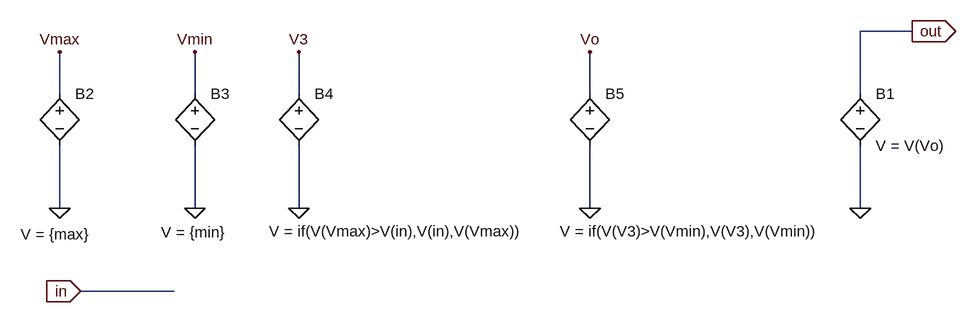
[diagram p0: schematic Clamp1.asc]
Clamp1.asc, the LTspice schematic file:
Version 4
SHEET 1 880 680
WIRE 704 -80 624 -80
WIRE -608 16 -608 -48
WIRE -400 16 -400 -48
WIRE -240 16 -240 -48
WIRE 208 16 208 -48
WIRE 624 16 624 -80
WIRE -608 192 -608 96
WIRE -400 192 -400 96
WIRE -240 192 -240 96
WIRE 208 192 208 96
WIRE 624 192 624 96
WIRE -432 320 -576 320
FLAG 624 192 0
FLAG 704 -80 out
IOPIN 704 -80 Out
FLAG -608 192 0
FLAG -400 192 0
FLAG -576 320 in
IOPIN -576 320 In
FLAG -608 -48 Vmax
FLAG -400 -48 Vmin
FLAG -240 192 0
FLAG -240 -48 V3
FLAG 208 192 0
FLAG 208 -48 Vo
SYMBOL bv 624 0 R0
SYMATTR InstName B1
SYMATTR Value V = V(Vo)
SYMBOL bv -608 0 R0
WINDOW 3 -60 232 Left 0
SYMATTR Value V = {max}
SYMATTR InstName B2
SYMBOL bv -400 0 R0
WINDOW 3 -52 229 Left 0
SYMATTR Value V = {min}
SYMATTR InstName B3
SYMBOL bv -240 0 R0
WINDOW 3 -46 228 Left 0
SYMATTR Value V = if(V(Vmax)>V(in),V(in),V(Vmax))
SYMATTR InstName B4
SYMBOL bv 208 0 R0
WINDOW 3 -46 228 Left 0
SYMATTR Value V = if(V(V3)>V(Vmin),V(V3),V(Vmin))
SYMATTR InstName B5

The netlist it stands for:
* Clamp1.asc
B1 out 0 V = V(Vo)
B2 Vmax 0 V = {max}
B3 Vmin 0 V = {min}
B4 V3 0 V = if(V(Vmax)>V(in),V(in),V(Vmax))
B5 Vo 0 V = if(V(V3)>V(Vmin),V(V3),V(Vmin))
.backanno
.end